# Altium schematic sheet n-watch v2.0_2022-03-19.schdoc
size 309 x 217 mm
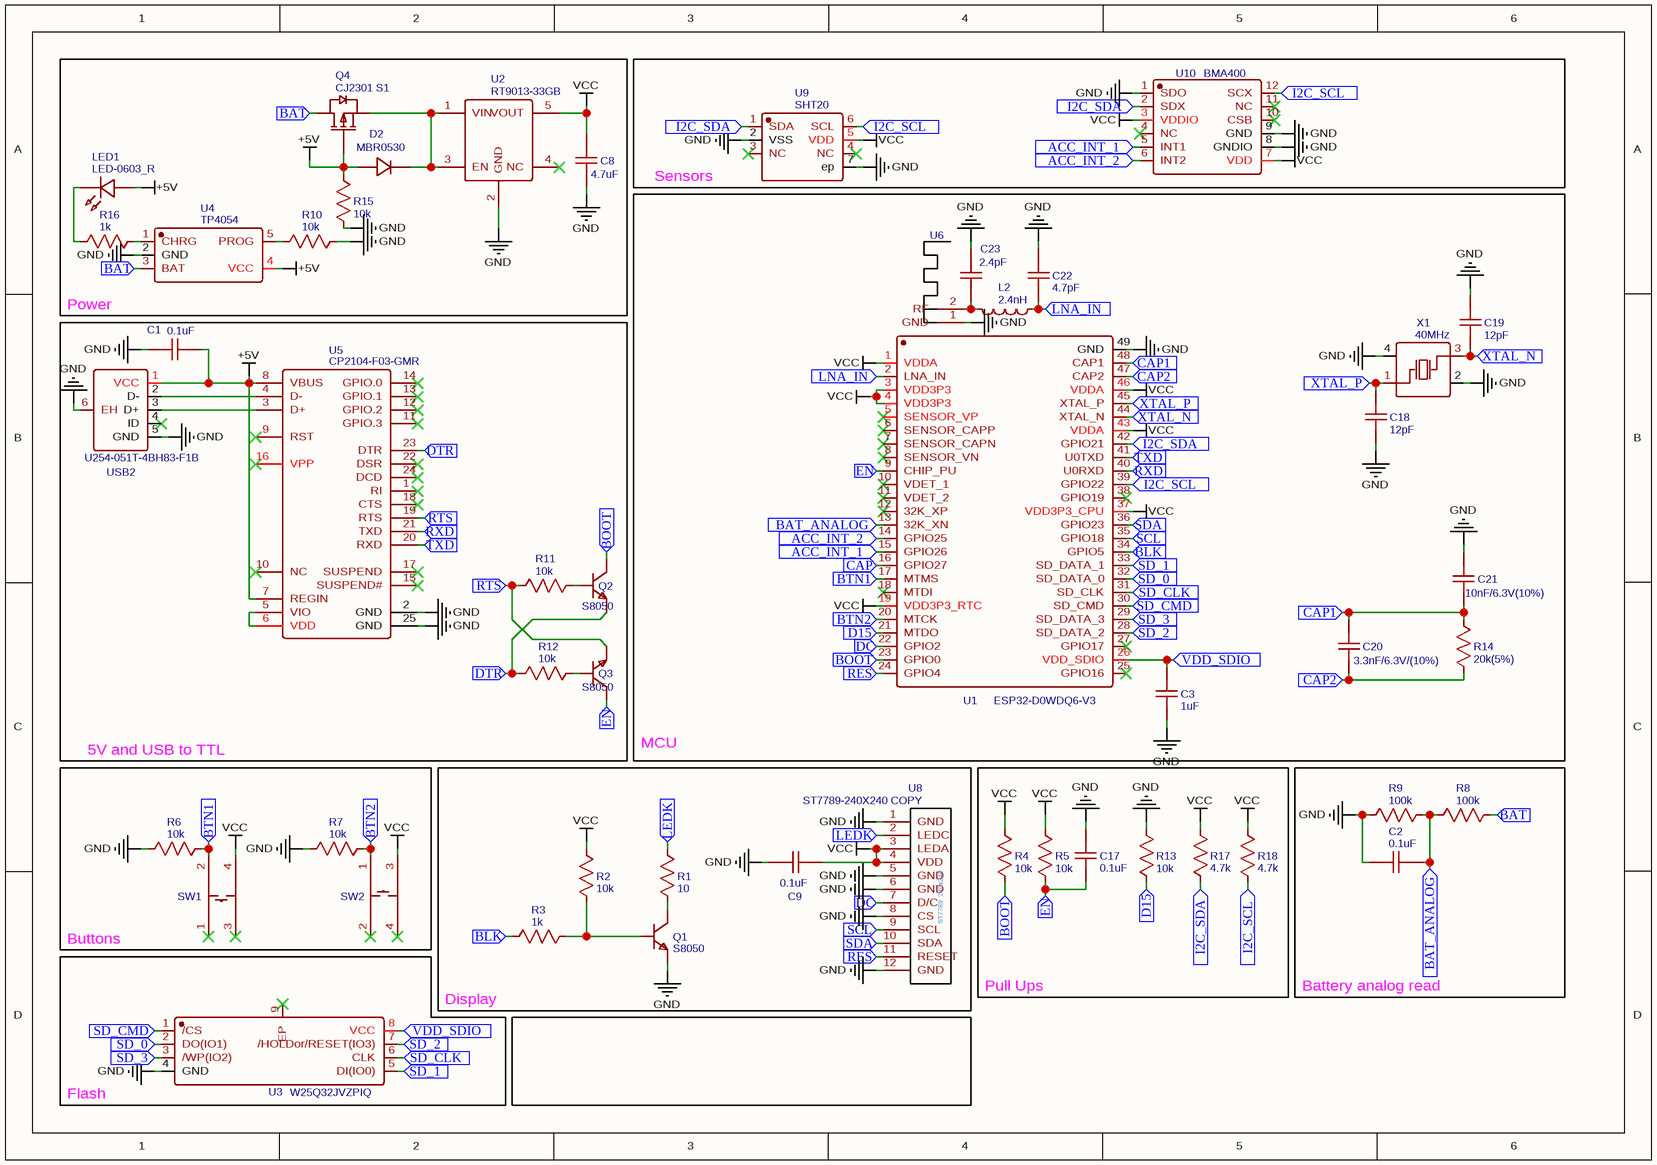
[diagram p0: n-watch v2.0_2022-03-19.schdoc]

## Parts
C1  0.1uF  [C0402]
C2  0.1uF  [C0402]
C3  1uF  [C0402]
C8  4.7uF  [C0402]
C9  0.1uF  [C0402]
C17  0.1uF  [C0402]
C18  12pF  [C0402]
C19  12pF  [C0402]
C20  3.3nF/6.3V/(10%)  [C0402]
C21  10nF/6.3V(10%)  [C0402]
C22  4.7pF  [C0402]
C23  2.4pF  [C0402]
D2  MBR0530  [SOD-123_L2.8-W1.8-LS3.7-RD]
L2  2.4nH  [L0402]
LED1  LED-0603_R  [LED0603_RED]
Q1  S8050  [SOT-23-3_L2.9-W1.3-P1.90-LS2.4-BR]
Q2  S8050  [SOT-23-3_L2.9-W1.3-P1.90-LS2.4-BR]
Q3  S8050  [SOT-23-3_L2.9-W1.3-P1.90-LS2.4-BR]
Q4  CJ2301 S1  [SOT-23-3_L3.0-W1.7-P0.95-LS2.9-BR]
R1  10  [R0402]
R2  10k  [R0402]
R3  1k  [R0402]
R4  10k  [R0402]
R5  10k  [R0402]
R6  10k  [R0402]
R7  10k  [R0402]
R8  100k  [R0402]
R9  100k  [R0402]
R10  10k  [R0402]
R11  10k  [R0402]
R12  10k  [R0402]
R13  10k  [R0402]
R14  20k(5%)  [R0402]
R15  10k  [R0402]
R16  1k  [R0402]
R17  4.7k  [R0402]
R18  4.7k  [R0402]
SW1  K2-1114SA-A4SW-06  [KEY-SMD_4P-L4.8-W4.6-P1.70-LS6.2]  (value not drawn)
SW2  K2-1114SA-A4SW-06  [KEY-SMD_4P-L4.8-W4.6-P1.70-LS6.2]  (value not drawn)
U1  ESP32-D0WDQ6-V3  [QFN-48_L6.0-W6.0-P0.40-BL-EP4.2]
U2  RT9013-33GB  [SOT-23-5]
U3  W25Q32JVZPIQ  [WSON-8_L6.0-W5.0-P1.27-BL-EP]
U4  TP4054  [SOT-23-5_L3.0-W1.7-P0.95-LS2.8-BR]
U5  CP2104-F03-GMR  [QFN-24_L4.0-W4.0-P0.50-BL-EP2.6]
U6  PCB ANTENNA 2.4GHZ UNDER MASK  [PCB ANTENNA 2.4GHZ]  (value not drawn)
U8  ST7789-240X240 COPY  [ST7789-240X240_NAIDAN]
U9  SHT20  [DFN-6_L3.0-W3.0-P0.95-TR-EP]
U10  BMA400  [LGA-12_L2.0-W2.0-P0.50-BL]
USB2  U254-051T-4BH83-F1B  [MINI-USB-SMD_U254-051T-4BH83-F1B]
X1  40MHz  [OSC-SMD_4P-L3.2-W2.5-BL]

## Blocks framed on the sheet
Power: C8 D2 LED1 Q4 R10 R15 R16 U2 U4
Sensors: U9 U10
MCU: C3 C18-C23 L2 R14 U1 U6 X1
5V and USB to TTL: C1 Q2 Q3 R11 R12 U5 USB2
Pull Ups: C17 R4 R5 R13 R17 R18
Battery analog read: C2 R8 R9

## Ports
ACC_INT_1 (in), ACC_INT_2 (in), BAT (in), BAT_ANALOG (in), BLK (in), BOOT (in), BTN1 (in), BTN2 (in), CAP1 (in), CAP2 (in), CAP (in), D15 (in), DC (in), DTR (in), EN (in), I2C_SCL (in), I2C_SDA (in), LEDK (in), LNA_IN (in), RES (in), RTS (in), RXD (in), SCL (in), SD_0 (in), SD_1 (in), SD_2 (in), SD_3 (in), SD_CLK (in), SD_CMD (in), SDA (in), TXD (in), VDD_SDIO (in), XTAL_N (in), XTAL_P (in)

## Nets
+5V: C1.1 D2.2(A) LED1.1 Q4.1(G) R15.2 U4.4(VCC) U5.7(REGIN) U5.8(VBUS) USB2.1(VCC)
GND: C1.2 C2.1 C3.1 C8.1 C9.1 C17.2 C18.1 C19.2 C21.2 C22.1 C23.2 Q1.2(E) R6.1 R7.1 R9.2 R10.2 R13.2 R15.1 U1.49(GND) U2.2(GND) U3.4(GND) U4.2(GND) U5.2(GND) U5.25(GND) U6.1(GND) U8.1(GND) U8.5(GND) U8.6(GND) U8.8(CS) U8.12(GND) U9.2(VSS) U9.7(ep) U10.1(SDO) U10.8(GNDIO) U10.9(GND) USB2.5(GND) USB2.6(EH) X1.2(GND) X1.4(GND)
VCC: C8.2 C9.2 R2.2 R4.2 R5.2 R17.2 R18.2 SW1.4 SW2.3 U1.1(VDDA) U1.3(VDD3P3) U1.4(VDD3P3) U1.19(VDD3P3_RTC) U1.37(VDD3P3_CPU) U1.43(VDDA) U1.46(VDDA) U2.5(VOUT) U8.3(LEDA) U8.4(VDD) U9.5(VDD) U10.3(VDDIO) U10.7(VDD)
ACC_INT_1: U1.15(GPIO26) U10.5(INT1) ; port ACC_INT_1
ACC_INT_2: U1.14(GPIO25) U10.6(INT2) ; port ACC_INT_2
BAT: Q4.3(D) R8.1 U4.3(BAT) ; port BAT
BAT_ANALOG: C2.2 R8.2 R9.1 U1.13(32K_XN) ; port BAT_ANALOG
BLK: R3.2 U1.34(GPIO5) ; port BLK
BOOT: Q2.3(C) R4.1 U1.23(GPIO0) ; port BOOT
BTN1: R6.2 SW1.2 U1.17(MTMS) ; port BTN1
BTN2: R7.2 SW2.1 U1.20(MTCK) ; port BTN2
CAP: U1.16(GPIO27) ; port CAP
CAP1: C20.2 C21.1 R14.2 U1.48(CAP1) ; port CAP1
CAP2: C20.1 R14.1 U1.47(CAP2) ; port CAP2
D15: R13.1 U1.21(MTDO) ; port D15
DC: U1.22(GPIO2) U8.7(D/C) ; port DC
DTR: Q2.2(E) R12.1 U5.23(DTR) ; port DTR
EN: C17.1 Q3.3(C) R5.1 U1.9(CHIP_PU) ; port EN
I2C_SCL: R18.1 U1.39(GPIO22) U9.6(SCL) U10.12(SCX) ; port I2C_SCL
I2C_SDA: R17.1 U1.42(GPIO21) U9.1(SDA) U10.2(SDX) ; port I2C_SDA
LEDK: R1.2 U8.2(LEDC) ; port LEDK
LNA_IN: C22.2 L2.1 U1.2(LNA_IN) ; port LNA_IN
RES: U1.24(GPIO4) U8.11(RESET) ; port RES
RTS: Q3.2(E) R11.2 U5.19(RTS) ; port RTS
RXD: U1.40(U0RXD) U5.21(TXD) ; port RXD
SCL: U1.35(GPIO18) U8.9(SCL) ; port SCL
SD_0: U1.32(SD_DATA_0) U3.2(DO(IO1)) ; port SD_0
SD_1: U1.33(SD_DATA_1) U3.5(DI(IO0)) ; port SD_1
SD_2: U1.28(SD_DATA_2) U3.7(/HOLDor/RESET(IO3)) ; port SD_2
SD_3: U1.29(SD_DATA_3) U3.3(/WP(IO2)) ; port SD_3
SD_CLK: U1.31(SD_CLK) U3.6(CLK) ; port SD_CLK
SD_CMD: U1.30(SD_CMD) U3.1(/CS) ; port SD_CMD
SDA: U1.36(GPIO23) U8.10(SDA) ; port SDA
TXD: U1.41(U0TXD) U5.20(RXD) ; port TXD
VDD_SDIO: C3.2 U1.26(VDD_SDIO) U3.8(VCC) ; port VDD_SDIO
XTAL_N: C19.1 U1.44(XTAL_N) X1.3(OSC2) ; port XTAL_N
XTAL_P: C18.2 U1.45(XTAL_P) X1.1(OSC1) ; port XTAL_P
NetC23_1: C23.1 L2.2 U6.2(RF)
NetD2_1: D2.1(C) Q4.2(S) U2.1(VIN) U2.3(EN)
NetLED1_2: LED1.2 R16.1
NetQ1_1: Q1.1(B) R2.1 R3.1
NetQ1_3: Q1.3(C) R1.1
NetQ2_1: Q2.1(B) R11.1
NetQ3_1: Q3.1(B) R12.2
NetR10_1: R10.1 U4.5(PROG)
NetR16_2: R16.2 U4.1(CHRG)
NetU5_3: U5.3(D+) USB2.3(D+)
NetU5_4: U5.4(D-) USB2.2(D-)
NetU5_5: U5.5(VIO) U5.6(VDD)

Not connected (* = marked no-connect by the designer): SW1 1* 3*; SW2 2* 4*; U1 5(SENSOR_VP)* 6(SENSOR_CAPP)* 7(SENSOR_CAPN)* 8(SENSOR_VN)* 10(VDET_1)* 11(VDET_2)* 12(32K_XP)* 18(MTDI)* 25(GPIO16)* 27(GPIO17)* 38(GPIO19)*; U2 4(NC)*; U3 9(EP)*; U5 1(RI)* 9(RST)* 10(NC)* 11(GPIO.3)* 12(GPIO.2)* 13(GPIO.1)* 14(GPIO.0)* 15(SUSPEND#)* 16(VPP)* 17(SUSPEND)* 18(CTS)* 22(DSR)* 24(DCD)*; U9 3(NC)* 4(NC)*; U10 4(NC)* 10(CSB)* 11(NC)*; USB2 4(ID)*

## Notes on the sheet
- Buttons
- Display
- Flash
- (in symbol ST7789-240X240 COPY) ST7789  240x240

## Library data of the parts
C1 C2 C9 C17 = 0.1uF: nameAlias: Value(F); Contributor: LCEDA_Lib; spicePre: C; spiceSymbolName: C_0402_US
C3 = 1uF: nameAlias: Value(F); Contributor: LCEDA_Lib; spicePre: C; spiceSymbolName: C_0402_US
C8 = 4.7uF: nameAlias: Value(F); Contributor: LCEDA_Lib; spicePre: C; spiceSymbolName: C_0402_US
C18 C19 = 12pF: nameAlias: Value(F); Contributor: LCEDA_Lib; spicePre: C; spiceSymbolName: C_0402_US
C20 = 3.3nF/6.3V/(10%): nameAlias: Value(F); Contributor: LCEDA_Lib; spicePre: C; spiceSymbolName: C_0402_US
C21 = 10nF/6.3V(10%): nameAlias: Value(F); Contributor: LCEDA_Lib; spicePre: C; spiceSymbolName: C_0402_US
C22 = 4.7pF: nameAlias: Value(F); Contributor: LCEDA_Lib; spicePre: C; spiceSymbolName: C_0402_US
C23 = 2.4pF: nameAlias: Value(F); Contributor: LCEDA_Lib; spicePre: C; spiceSymbolName: C_0402_US
D2 = MBR0530: BOM_Manufacturer: CJ; BOM_Supplier: LCSC; BOM_Manufacturer Part: MBR0530; BOM_Supplier Part: C77336; BOM_JLCPCB Part Class: Extended Part; spicePre: D; spiceSymbolName: MBR0530
L2 = 2.4nH: nameAlias: Value(H); Contributor: LCEDA_Lib; spicePre: L; spiceSymbolName: L0402_US
LED1 = LED-0603_R: BOM_Manufacturer: EVERLIGHT(台湾亿光); BOM_Manufacturer Part: 19-217/R6C-AL1M2VY/3T; Contributor: LCEDA_01; BOM_Supplier Part: C72044; BOM_Supplier: LCSC; spicePre: L; spiceSymbolName: LED-0603_R
Q1-Q3 = S8050: BOM_Manufacturer: JSMSEMI; Contributor: LCSC; BOM_Supplier: LCSC; BOM_Supplier Part: C916390; BOM_Manufacturer Part: S8050; BOM_JLCPCB Part Class: Extended Part; spicePre: Q; spiceSymbolName: S8050
Q4 = CJ2301 S1: BOM_Manufacturer: CJ; BOM_Supplier: LCSC; BOM_Manufacturer Part: CJ2301 S1; BOM_Supplier Part: C8547; BOM_JLCPCB Part Class: Extended Part; spicePre: Q; spiceSymbolName: CJ2301 S1
R1 = 10: nameAlias: Value(Ω); Contributor: LCEDA_Lib; spicePre: R; spiceSymbolName: R_0603_US
R2 R4-R7 R10-R13 R15 = 10k: nameAlias: Value(Ω); Contributor: LCEDA_Lib; spicePre: R
  R2: spiceSymbolName: R_0603_US
  R4-R7 R10-R13 R15: spiceSymbolName: R_0402_US
R3 R16 = 1k: nameAlias: Value(Ω); Contributor: LCEDA_Lib; spicePre: R
  R3: spiceSymbolName: R_0603_US
  R16: spiceSymbolName: R_0402_US
R8 R9 = 100k: nameAlias: Value(Ω); Contributor: LCEDA_Lib; spicePre: R; spiceSymbolName: R_0603_US
R14 = 20k(5%): nameAlias: Value(Ω); Contributor: LCEDA_Lib; spicePre: R; spiceSymbolName: R_0402_US
R17 R18 = 4.7k: nameAlias: Value(Ω); Contributor: LCEDA_Lib; spicePre: R; spiceSymbolName: R_0402_US
SW1 SW2 = K2-1114SA-A4SW-06: BOM_Manufacturer: HRO; Contributor: LCSC; BOM_Supplier: LCSC; BOM_Manufacturer Part: K2-1114SA-A4SW-06; BOM_Supplier Part: C136662; BOM_JLCPCB Part Class: Extended Part; spicePre: S; spiceSymbolName: K2-1114SA-A4SW-06
U1 = ESP32-D0WDQ6-V3: BOM_Manufacturer: ESPRESSIF 乐鑫; Contributor: LCSC; BOM_Supplier: LCSC; BOM_Supplier Part: C967020; BOM_Manufacturer Part: ESP32-D0WDQ6-V3; BOM_JLCPCB Part Class: Extended Part; spicePre: U; spiceSymbolName: ESP32-D0WDQ6-V3
U2 = RT9013-33GB: BOM_Manufacturer: RICHTEK; SMT Type: Extend; Contributor: catech75; BOM_Supplier: LCSC; BOM_Manufacturer Part: RT9013-33GB; image: //image.lceda.cn/szlcsc/C47773.jpg; BOM_Supplier Part: C47773; BOM_LCSC Assembly: Yes; spicePre: U; spiceSymbolName: RT9013-33GB
U3 = W25Q32JVZPIQ: BOM_Manufacturer: Winbond Elec; Contributor: LCSC; BOM_Supplier: LCSC; BOM_Supplier Part: C571260; BOM_Manufacturer Part: W25Q32JVZPIQ; BOM_JLCPCB Part Class: Extended Part; spicePre: U; spiceSymbolName: W25Q32JVZPIQ
U4 = TP4054: BOM_Manufacturer: TOPPOWER; sourceId: dx642CAWU; Contributor: kyle.hu.gz; BOM_Supplier: LCSC; BOM_Manufacturer Part: TP4054; BOM_Supplier Part: C32574; BOM_JLCPCB Part Class: Basic Part; spicePre: U; spiceSymbolName: TP4054
U5 = CP2104-F03-GMR: BOM_Manufacturer: SILICON LABS; Contributor: LCSC; BOM_Supplier: LCSC; BOM_Manufacturer Part: CP2104-F03-GMR; BOM_Supplier Part: C47015; BOM_JLCPCB Part Class: Extended Part; spicePre: U; spiceSymbolName: CP2104-F03-GMR
U6 = PCB ANTENNA 2.4GHZ UNDER MASK: Contributor: matuhinmax; spicePre: U; spiceSymbolName: PCB ANTENNA 2.4GHZ UNDER MASK
U8 = ST7789-240X240 COPY: Contributor: peut; spicePre: U; spiceSymbolName: ST7789-240X240 COPY
U9 = SHT20: BOM_Manufacturer: Sensirion; BOM_Supplier: LCSC; BOM_Manufacturer Part: SHT20; BOM_Supplier Part: C53865; BOM_JLCPCB Part Class: Extended Part; spicePre: U; spiceSymbolName: SHT20
U10 = BMA400: BOM_Manufacturer: Bosch Sensortec; Contributor: LCSC; BOM_Supplier: LCSC; BOM_Supplier Part: C437655; BOM_Manufacturer Part: BMA400; BOM_JLCPCB Part Class: Extended Part; spicePre: U; spiceSymbolName: BMA400
USB2 = U254-051T-4BH83-F1B: BOM_Manufacturer: XKB Enterprise; Contributor: LCSC; BOM_Supplier: LCSC; BOM_Supplier Part: C319162; BOM_Manufacturer Part: U254-051T-4BH83-F1B; BOM_JLCPCB Part Class: Extended Part; spicePre: U; spiceSymbolName: U254-051T-4BH83-F1B
X1 = 40MHz: BOM_Manufacturer: TKD; BOM_Manufacturer Part: 3225-40M-12PF-10PPM; nameAlias: Frequency; Contributor: LCSC; BOM_Supplier: LCSC; BOM_Supplier Part: C337678; spicePre: X; spiceSymbolName: 3225-40M-12PF-10PPM